# EAGLE schematic Communication (EAGLE 8.6.1)
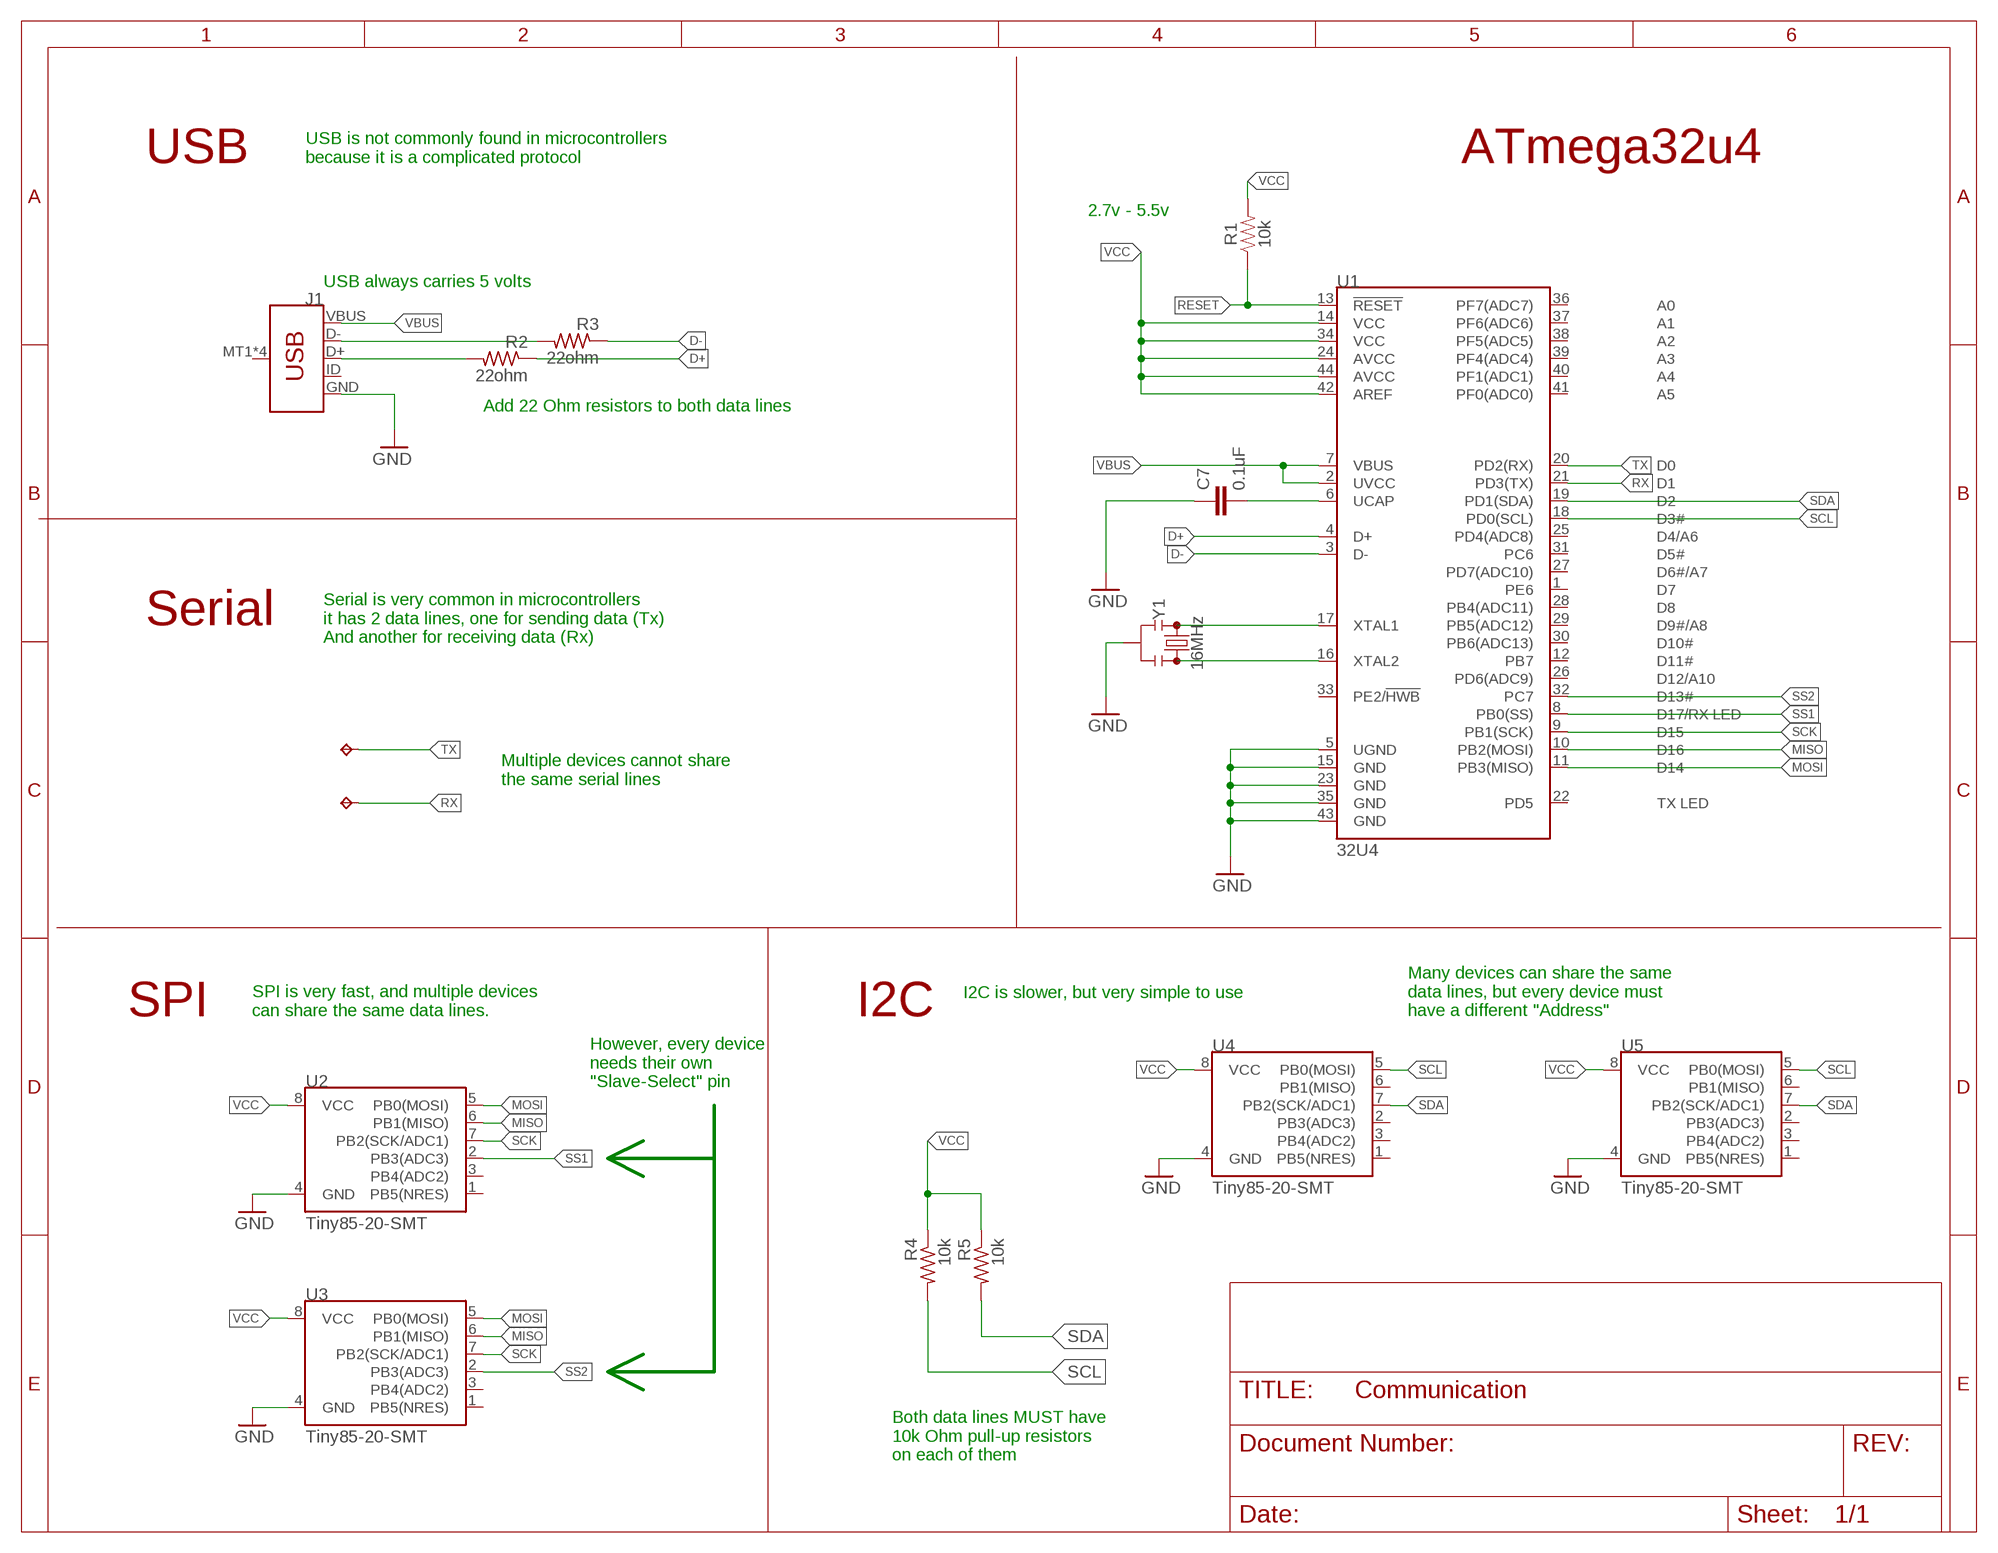
[diagram p0: schematic, sheet 1]

## Parts
C7  0.1uF  0.1UF-0603-25V-5%  [0603]
J1  USB_MICRO-B_SMT  [USB-MICROB]
R1  10k  10KOHM-0603-1/10W-1%  [0603]
R2  22ohm  R-US_R0603  [R0603]
R3  22ohm  R-US_R0603  [R0603]
R4  10k  R-US_R0603  [R0603]
R5  10k  R-US_R0603  [R0603]
TP1  TPTP20R  [TP20R]
TP2  TPTP20R  [TP20R]
U1  32U4  ATMEGA32U4TQFP-44  [TQFP44]
U2  Tiny85-20-SMT  ATTINY45TINY85-20-SMT  [SO08-EIAJ_MCU]
U3  Tiny85-20-SMT  ATTINY45TINY85-20-SMT  [SO08-EIAJ_MCU]
U4  Tiny85-20-SMT  ATTINY45TINY85-20-SMT  [SO08-EIAJ_MCU]
U5  Tiny85-20-SMT  ATTINY45TINY85-20-SMT  [SO08-EIAJ_MCU]
Y1  16MHz  RESONATOR-16MHZSMD_3.2X1.3  [RESONATOR-SMD-3.2X1.3]

## Nets
D+: R2.1 U1.4(D+)
D-: R3.1 U1.3(D-)
GND: C7.1 J1.GND U1.5(UGND) U1.15(GND) U1.23(GND) U1.35(GND) U1.43(GND) U2.4(GND) U3.4(GND) U4.4(GND) U5.4(GND) Y1.2
MISO: U1.10(PB2(MOSI)) U2.6(PB1(MISO)) U3.6(PB1(MISO))
MOSI: U1.11(PB3(MISO)) U2.5(PB0(MOSI)) U3.5(PB0(MOSI))
N$1: C7.2 U1.6(UCAP)
N$2: U1.17(XTAL1) Y1.1
N$3: U1.16(XTAL2) Y1.3
N$5: J1.D- R3.2
N$6: J1.D+ R2.2
RESET: R1.1 U1.13(!RESET)
RX: TP2.TP U1.21(PD3(TX))
SCK: U1.9(PB1(SCK)) U2.7(PB2(SCK/ADC1)) U3.7(PB2(SCK/ADC1))
SCL: R4.2 U1.18(PD0(SCL)) U4.5(PB0(MOSI)) U5.5(PB0(MOSI))
SDA: R5.2 U1.19(PD1(SDA)) U4.7(PB2(SCK/ADC1)) U5.7(PB2(SCK/ADC1))
SS1: U1.8(PB0(SS)) U2.2(PB3(ADC3))
SS2: U1.32(PC7) U3.2(PB3(ADC3))
TX: TP1.TP U1.20(PD2(RX))
VBUS: J1.VBUS U1.2(UVCC) U1.7(VBUS)
VCC: R1.2 R4.1 R5.1 U1.14(VCC) U1.24(AVCC) U1.34(VCC) U1.42(AREF) U1.44(AVCC) U2.8(VCC) U3.8(VCC) U4.8(VCC) U5.8(VCC)
Unconnected: J1.ID J1.MT1(SHIELD) J1.MT2(SHIELD) J1.P$1(SHIELD) J1.P$2(SHIELD) U1.1(PE6) U1.12(PB7) U1.22(PD5) U1.25(PD4(ADC8)) U1.26(PD6(ADC9)) U1.27(PD7(ADC10)) U1.28(PB4(ADC11)) U1.29(PB5(ADC12)) U1.30(PB6(ADC13)) U1.31(PC6) U1.33(PE2/!HWB) U1.36(PF7(ADC7)) U1.37(PF6(ADC6)) U1.38(PF5(ADC5)) U1.39(PF4(ADC4)) U1.40(PF1(ADC1)) U1.41(PF0(ADC0)) U2.1(PB5(NRES)) U2.3(PB4(ADC2)) U3.1(PB5(NRES)) U3.3(PB4(ADC2)) U4.1(PB5(NRES)) U4.2(PB3(ADC3)) U4.3(PB4(ADC2)) U4.6(PB1(MISO)) U5.1(PB5(NRES)) U5.2(PB3(ADC3)) U5.3(PB4(ADC2)) U5.6(PB1(MISO))

## Notes on the sheet
- USB
- USB is not commonly found in microcontrollers
  because it is a complicated protocol
- ATmega32u4
- 2.7v - 5.5v
- USB always carries 5 volts
- Add 22 Ohm resistors to both data lines
- Serial
- Serial is very common in microcontrollers
  it has 2 data lines, one for sending data (Tx)
  And another for receiving data (Rx)
- Multiple devices cannot share
  the same serial lines
- I2C is slower, but very simple to use
- SPI
- SPI is very fast, and multiple devices
  can share the same data lines.
- I2C
- Many devices can share the same
  data lines, but every device must
  have a different "Address"
- However, every device
  needs their own
  "Slave-Select" pin
- Both data lines MUST have
  10k Ohm pull-up resistors
  on each of them

## Library data of the parts
C7 = SparkFun-Capacitors:0.1UF: 0.1µF ceramic capacitors A capacitor is a passive two-terminal electrical component used to store electrical energy temporarily in an electric field.; PROD_ID: CAP-08604
J1 = SparkFun-Connectors:USB_MICRO-B: USB Type Micro-B Connector Male/female and PTH/SMT variants SparkFun Products: SparkFun microB USB Breakout <https://www.sparkfun.com/products/12035> SparkFun USB microB Plug Breakout <https://www.sparkfun.com/products/10031> SparkFun ESP8266 Thing <https://www.sparkfun.com/products/13231>; PROD_ID: CONN-09505; SF_ID: PRT-08533
R1 = SparkFun-Resistors:10KOHM: 10kΩ resistor A resistor is a passive two-terminal electrical component that implements electrical resistance as a circuit element. Resistors act to reduce current flow, and, at the same time, act to lower voltage levels within circuits. - Wikipedia; PROD_ID: RES-00824
R2-R5 = adafruit:R-US_: RESISTOR, American symbol
TP1 TP2 = testpad:TP: Test pad
U1 = SparkFun-IC-Microcontroller:ATMEGA32U4: Atmel MCU, 32KByte Atmel 44-pin 8-bit Microcontroller with 32KBytes of ISP Flash and USB Controller Datasheet <http://cdn.sparkfun.com/datasheets/Dev/Arduino/Boards/ATMega32U4.pdf> SparkFun Products LilyPad Arduino USB - ATmega32U4 Board <https://www.sparkfun.com/products/12049> (DEV-12049) Pro Micro - 5V/16MHz <https://www.sparkfun.com/products/12640> (DEV-12640) Pro Micro - 3.3V/8MHz <https://www.sparkfun.com/products/12587> (DEV-12587) Fio v3 - ATmega32U4 <https://www.sparkfun.com/products/11520> (DEV-11520) Qduino Mini <https://www.sparkfun.com/products/13614> (DEV-13614) Makey Makey - Standard Kit <https://www.sparkfun.com/products/11511> (WIG-11511) Makey Makey Deluxe Kit <https://www.sparkfun.com/products/11519> (WIG-11519); PROD_ID: IC-11161
U2-U5 = SparkFun-Retired:ATTINY45: Atmel 8-pin 2/4/8kB flash uC Retired; PROD_ID: IC-09092
Y1 = SparkFun-Clocks:RESONATOR-16MHZ: 16MHz Resonator Digikey Example <http://www.digikey.com/product-detail/en/murata-electronics-north-america/CSTCE16M0V53-R0/490-1198-1-ND/584635> Frequency: 16MHz Frequency Stability: ±0.3% Frequency Tolerance: ±0.5% Capacitance: 15pF SparkFun Products SparkFun OpenLog <https://www.sparkfun.com/products/13712> SparkFun MicroView - OLED Arduino Module <https://www.sparkfun.com/products/12923>; PROD_ID: XTAL-08900